# Altium schematic sheet SFPextension.SchDoc
size A4
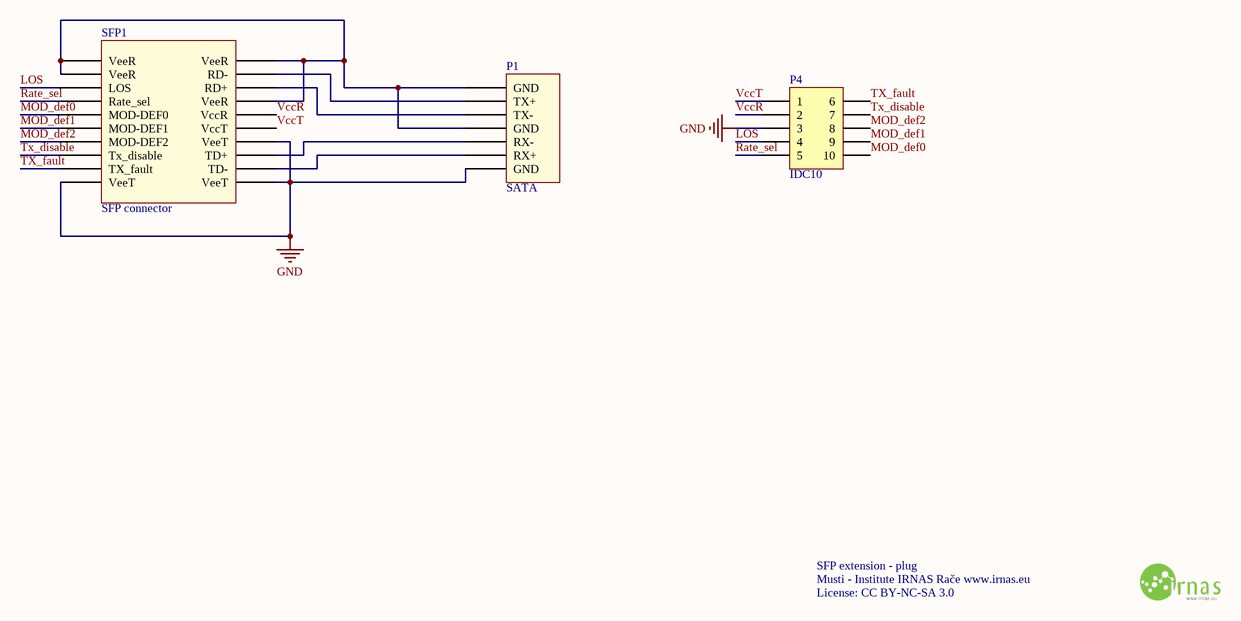
[diagram p0: SFPextension.SchDoc]

## Parts
P1  SATA  [SATA pcb]
P4  IDC10  [HDR2X5_CEN]
SFP1  SFP connector  [SFP pcb con]

## Nets
GND: P1.7(GND) P4.3 SFP1.1(VeeT) SFP1.17(VeeT) SFP1.20(VeeT)
LOS: P4.4 SFP1.8(LOS)
MOD_def0: P4.10 SFP1.6(MOD-DEF0)
MOD_def1: P4.9 SFP1.5(MOD-DEF1)
MOD_def2: P4.8 SFP1.4(MOD-DEF2)
Rate_sel: P4.5 SFP1.7(Rate_sel)
Tx_disable: P4.7 SFP1.3(Tx_disable)
TX_fault: P4.6 SFP1.2(TX_fault)
VccR: P4.2 SFP1.15(VccR)
VccT: P4.1 SFP1.16(VccT)
NetP1_1: P1.1(GND) P1.4(GND) SFP1.9(VeeR) SFP1.10(VeeR) SFP1.11(VeeR) SFP1.14(VeeR)
NetP1_2: P1.2(TX+) SFP1.12(RD-)
NetP1_3: P1.3(TX-) SFP1.13(RD+)
NetP1_5: P1.5(RX-) SFP1.18(TD+)
NetP1_6: P1.6(RX+) SFP1.19(TD-)

## Notes on the sheet
- SFP extension - plug
- Musti - Institute IRNAS Rače www.irnas.eu
- License: CC BY-NC-SA 3.0

## Library data of the parts
P4 = Header 5X2A: Header, 5-Pin, Dual row; LatestRevisionDate: 17-Jul-2002; LatestRevisionNote: Re-released for DXP Platform.; Publisher: Altium Limited